# Altium schematic sheet MCU.SchDoc
size 381 x 241 mm; SheetNumber: 5; SheetTotal: 8
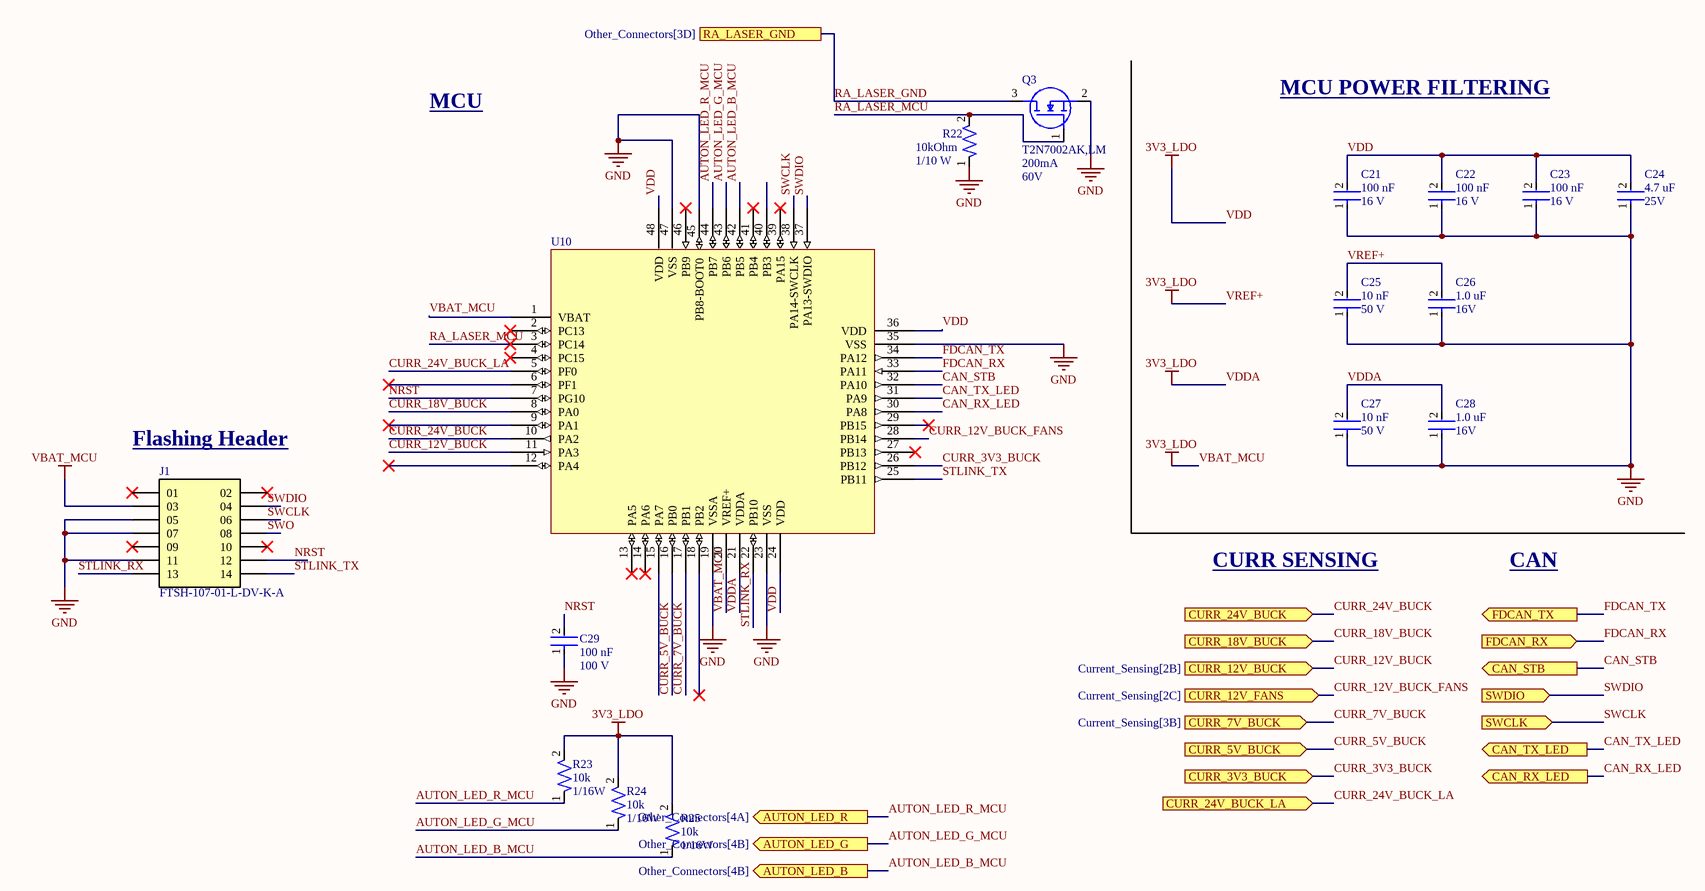
[diagram p0: MCU.SchDoc]

## Parts
C21  Voltage Rating: 16 V  Capacitance: 100 nF  [CAP-0402]  (hidden comment: CC0402KRX7R7BB104)
C22  Voltage Rating: 16 V  Capacitance: 100 nF  [CAP-0402]  (hidden comment: CC0402KRX7R7BB104)
C23  Voltage Rating: 16 V  Capacitance: 100 nF  [CAP-0402]  (hidden comment: CC0402KRX7R7BB104)
C24  Capacitance: 4.7 uF  Voltage: 25V  [CAP-0603]  (hidden comment: CC0603KRX5R8BB475)
C25  Voltage: 50 V  Capacitance: 10 nF  [CAP-0603]  (hidden comment: CC0603KPX7R9BB103)
C26  Capacitance: 1.0 uF  Voltage: 16V  [CAP-0603]  (hidden comment: CC0603KRX7R7BB105)
C27  Voltage: 50 V  Capacitance: 10 nF  [CAP-0603]  (hidden comment: CC0603KPX7R9BB103)
C28  Capacitance: 1.0 uF  Voltage: 16V  [CAP-0603]  (hidden comment: CC0603KRX7R7BB105)
C29  Capacitance: 100 nF  Voltage: 100 V  [CAP-0603]  (hidden comment: CC0603KRX7R0BB104)
J1  FTSH-107-01-L-DV-K-A  [SAMTEC_FTSH-107-01-L-DV-K]
Q3  T2N7002AK,LM  Id-Continuous: 200mA  VDS-Max: 60V  [NMOS-SOT23-3]
R22  Resistance: 10kOhm  Power: 1/10 W  [RES-0603]  (hidden comment: RMCF0603ZT0R00)
R23  Resistance: 10k  Power: 1/16W  [RES-0402]  (hidden comment: RC0402FR-0710KL)
R24  Resistance: 10k  Power: 1/16W  [RES-0402]  (hidden comment: RC0402FR-0710KL)
R25  Resistance: 10k  Power: 1/16W  [RES-0402]  (hidden comment: RC0402FR-0710KL)
U10  STM32G431CBT6  [IC-LQFP48]  (value not drawn)

## Ports
AUTON_LED_B (out, see Other_Connectors[4B]), AUTON_LED_G (out, see Other_Connectors[4B]), AUTON_LED_R (out, see Other_Connectors[4A]), CAN_RX_LED (out, see CAN_Transciever[1C]), CAN_STB (out, see CAN_Transciever[1C]), CAN_TX_LED (out, see CAN_Transciever[1C]), CURR_3V3_BUCK (in, see Current_Sensing[5B]), CURR_5V_BUCK (in, see Current_Sensing[5B]), CURR_7V_BUCK (in, see Current_Sensing[3B]), CURR_12V_BUCK (in, see Current_Sensing[2B]), CURR_12V_FANS (in, see Current_Sensing[2C]), CURR_18V_BUCK (in, see Current_Sensing[3B]), CURR_24V_BUCK (in, see Current_Sensing[2B]), CURR_24V_BUCK_LA (in, see Current_Sensing[4C]), FDCAN_RX (in, see CAN_Transciever[1C]), FDCAN_TX (out, see CAN_Transciever[1C]), RA_LASER_GND (see Other_Connectors[3D]), SWCLK (in), SWDIO (in)

## Nets
GND: C21.1 C22.1 C23.1 C24.1 C25.1 C26.1 C27.1 C28.1 C29.1 J1.05 J1.07 J1.11 Q3.2(S) R22.1 U10.19(VSSA) U10.23(VSS) U10.35(VSS) U10.45(PB8-BOOT0) U10.47(VSS)
VBAT_MCU: C21.2 C22.2 C23.2 C24.2 C25.2 C26.2 C27.2 C28.2 J1.03 R23.2 R24.2 R25.2 U10.1(VBAT) U10.20(VREF+) U10.21(VDDA) U10.24(VDD) U10.36(VDD) U10.48(VDD)  [also labelled 3V3_LDO, VDD, VDDA, VREF+]
AUTON_LED_B_MCU: R25.1 U10.42(PB5) ; port AUTON_LED_B
AUTON_LED_G_MCU: R24.1 U10.43(PB6) ; port AUTON_LED_G
AUTON_LED_R_MCU: R23.1 U10.44(PB7) ; port AUTON_LED_R
CAN_RX_LED: U10.30(PA8) ; port CAN_RX_LED
CAN_STB: U10.32(PA10) ; port CAN_STB
CAN_TX_LED: U10.31(PA9) ; port CAN_TX_LED
CURR_3V3_BUCK: U10.26(PB12) ; port CURR_3V3_BUCK
CURR_5V_BUCK: U10.16(PB0) ; port CURR_5V_BUCK
CURR_7V_BUCK: U10.17(PB1) ; port CURR_7V_BUCK
CURR_12V_BUCK: U10.11(PA3) ; port CURR_12V_BUCK
CURR_12V_BUCK_FANS: U10.28(PB14) ; port CURR_12V_FANS
CURR_18V_BUCK: U10.8(PA0) ; port CURR_18V_BUCK
CURR_24V_BUCK: U10.10(PA2) ; port CURR_24V_BUCK
CURR_24V_BUCK_LA: U10.5(PF0) ; port CURR_24V_BUCK_LA
FDCAN_RX: U10.33(PA11) ; port FDCAN_RX
FDCAN_TX: U10.34(PA12) ; port FDCAN_TX
NRST: C29.2 J1.12 U10.7(PG10)
RA_LASER_GND: Q3.3(D) ; port RA_LASER_GND
RA_LASER_MCU: Q3.1(G) R22.2 U10.3(PC14)
STLINK_RX: J1.13 U10.22(PB10)
STLINK_TX: J1.14 U10.25(PB11)
SWCLK: J1.06 U10.38(PA14-SWCLK) ; port SWCLK
SWDIO: J1.04 U10.37(PA13-SWDIO) ; port SWDIO
SWO: J1.08

Not connected (* = marked no-connect by the designer): J1 01* 02* 09* 10*; U10 2(PC13)* 4(PC15)* 6(PF1)* 9(PA1)* 12(PA4)* 13(PA5)* 14(PA6)* 15(PA7) 18(PB2)* 27(PB13)* 29(PB15)* 39(PA15)* 40(PB3) 41(PB4)* 46(PB9)*

## Notes on the sheet
- MCU
- MCU POWER FILTERING
- (near J1) Flashing Header
- CURR SENSING
- CAN

## Library data of the parts
C21-C23 = CAP-0.1U-0001: CAP CER 0.1UF 16V X7R 0402; ComponentLink2Description: Datasheet; ComponentLink2URL: https://www.yageo.com/upload/media/product/productsearch/datasheet/mlcc/UPY-GPHC_X7R_6.3V-to-250V_24.pdf; Device Class: Ceramic; Size: 0402
C24 = CAP-4.7U-0001: CAP CER 4.7UF 25V X5R 0603; Device Class: Ceramic; Size: 0603
C25 C27 = CAP-10N-0002: CAP CER 10000PF 50V X7R 0603; ComponentLink2Description: Datasheet; ComponentLink2URL: http://www.yageo.com/documents/recent/UPY-GPHC_X7R_6.3V-to-50V_18.pdf; Device Class: Ceramic; Size: 0603
C26 C28 = CAP-1U-0002: CAP CER 1UF 16V X7R 0603; Device Class: Ceramic; Size: 0603
C29 = CAP-100N-0001: CAP CER 0.1UF 100V X7R 0603; Device Class: Ceramic; Size: 0603; ComponentLink1Description: Datasheet; ComponentLink1URL: https://www.yageo.com/upload/media/product/app/datasheet/mlcc/upy-np0x7r_mv_100-to-630v.pdf
J1 = CONN-Flashing: Connector Header Surface Mount 14 position 0.050 (1.27mm); MF: Samtec Inc.; SnapEDA_Link: https://www.snapeda.com/parts/FTSH-107-01-L-DV-K-A/Samtec+Inc./view-part/?ref=snap; Package: None; Value: *; MP: FTSH-107-01-L-DV-K-A; Check_prices: https://www.snapeda.com/parts/FTSH-107-01-L-DV-K-A/Samtec+Inc./view-part/?ref=eda; ComponentLink1Description: Datasheet; ComponentLink1URL: https://mm.digikey.com/Volume0/opasdata/d220001/medias/docus/6209/ftsh-1xx-xx-xxx-dv-xxx-xxx-x-xx-mkt.pdf?_gl=1*1c8qhrp*_up*MQ..*_gs*MQ..&gclid=Cj0KCQjwndHEBhDVARIsAGh0g3BhbAROHH0tQxim6dYiCi7CVIKM-WvKYR8T8zWoEwepZ3CPXWTcBI4aAtXsEALw_wcB&gclsrc=aw.ds&gbraid=0AAAAADrbLlju0DZp9CUD_BKsHNp-CszV5
Q3 = NMOS-200MA-0001: MOSFET N-CH 60V 200MA SOT23; Manufacturer: Toshiba; FET type: N-Channel; Rds On-Max: 3.9Ohm; Vgs-Max: 20V; Assembled?: no; Manufacturer Part Number: T2N7002AK,LM; Package: SOT-23-3
R22 = RES-0-0001: 0 Ohms Jumper 0.1W, 1/10W Chip Resistor 0603 (1608 Metric) Automotive AEC-Q200 Thick Film; Package Size: 0603
R23-R25 = RES-10k-0001: RES 10K OHM 1% 1/16W 0402; Tolerance: 1%; Size: 0402; ComponentLink1Description: Datasheet; ComponentLink1URL: https://www.yageo.com/upload/media/product/products/datasheet/rchip/PYu-RC_Group_51_RoHS_L_12.pdf
U10 = IC-STM32G431CBT6: IC MCU 32BIT 128KB FLASH 48LQFP; Package: 48LQFP; ComponentLink1Description: Datasheet; ComponentLink1URL: https://www.st.com/resource/en/datasheet/stm32g431cb.pdf